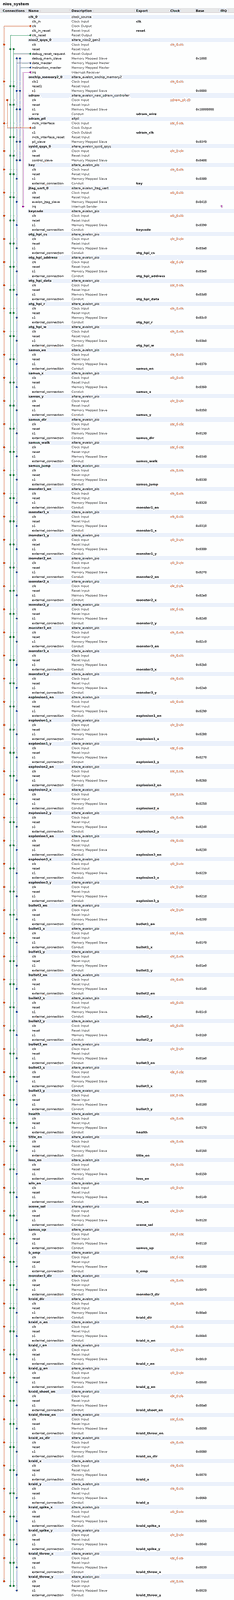
[diagram p0: system contents, whole]
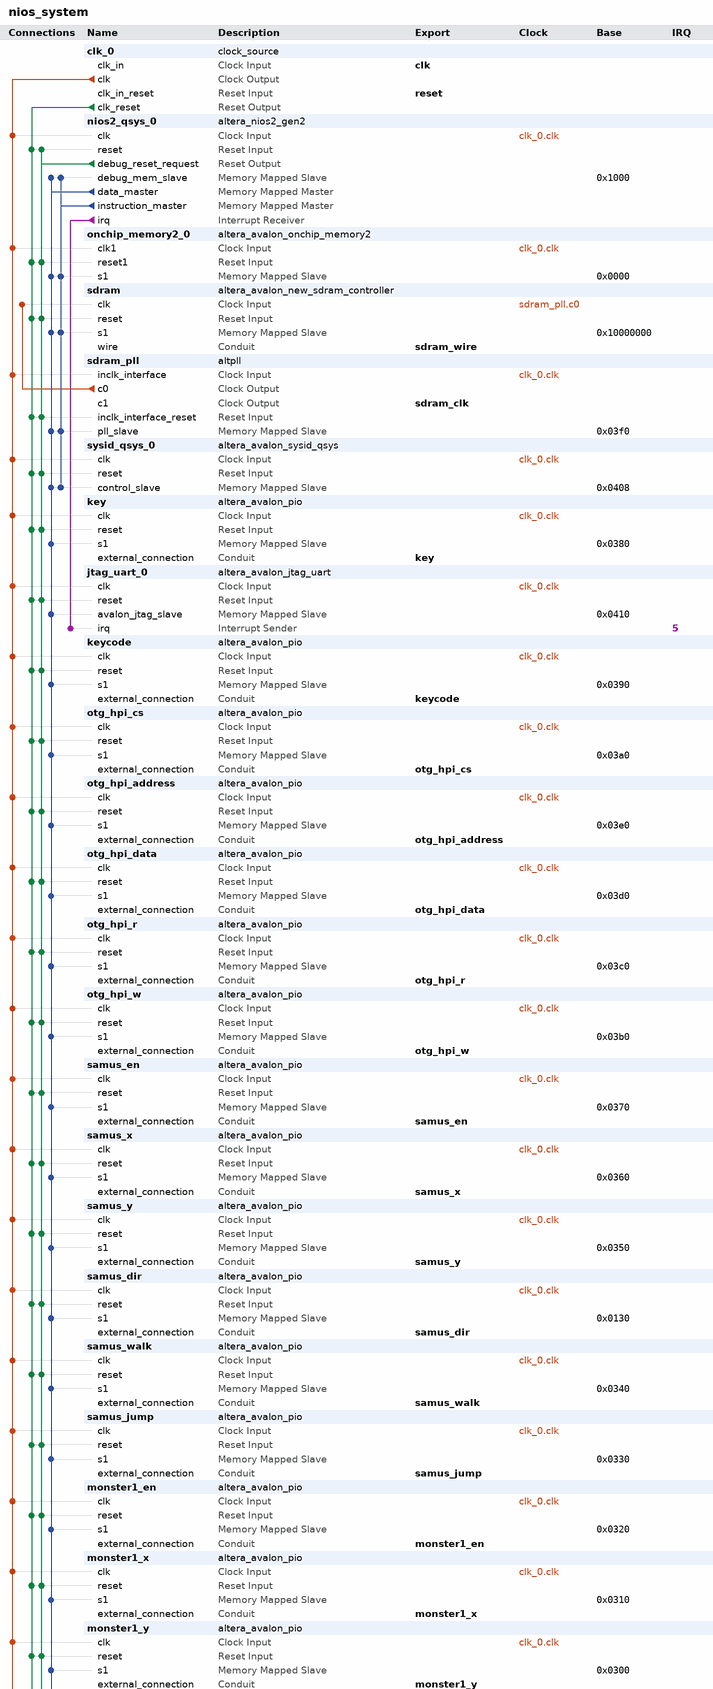
[diagram p1: system contents, upper part]
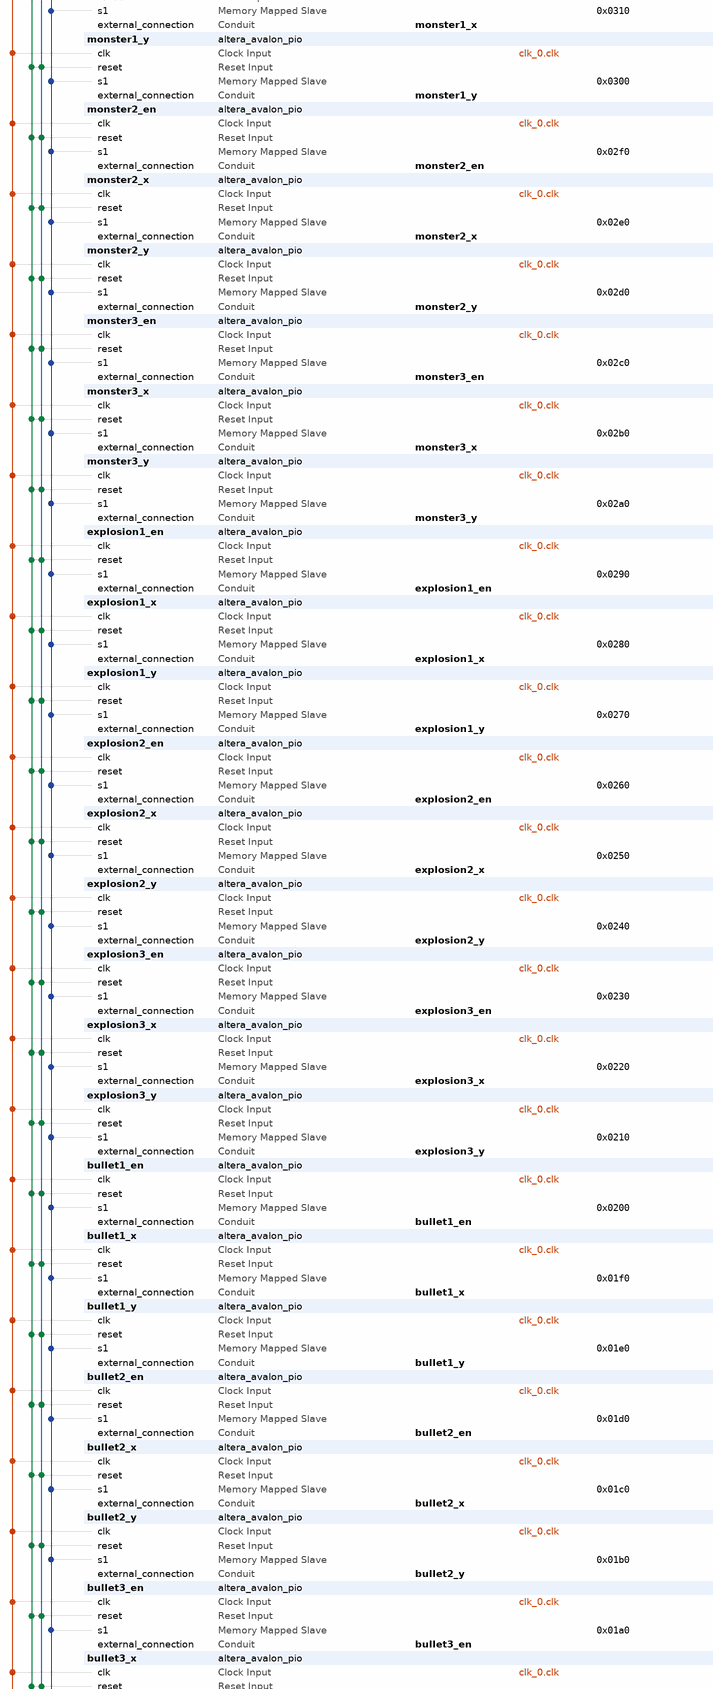
[diagram p2: system contents, middle part]
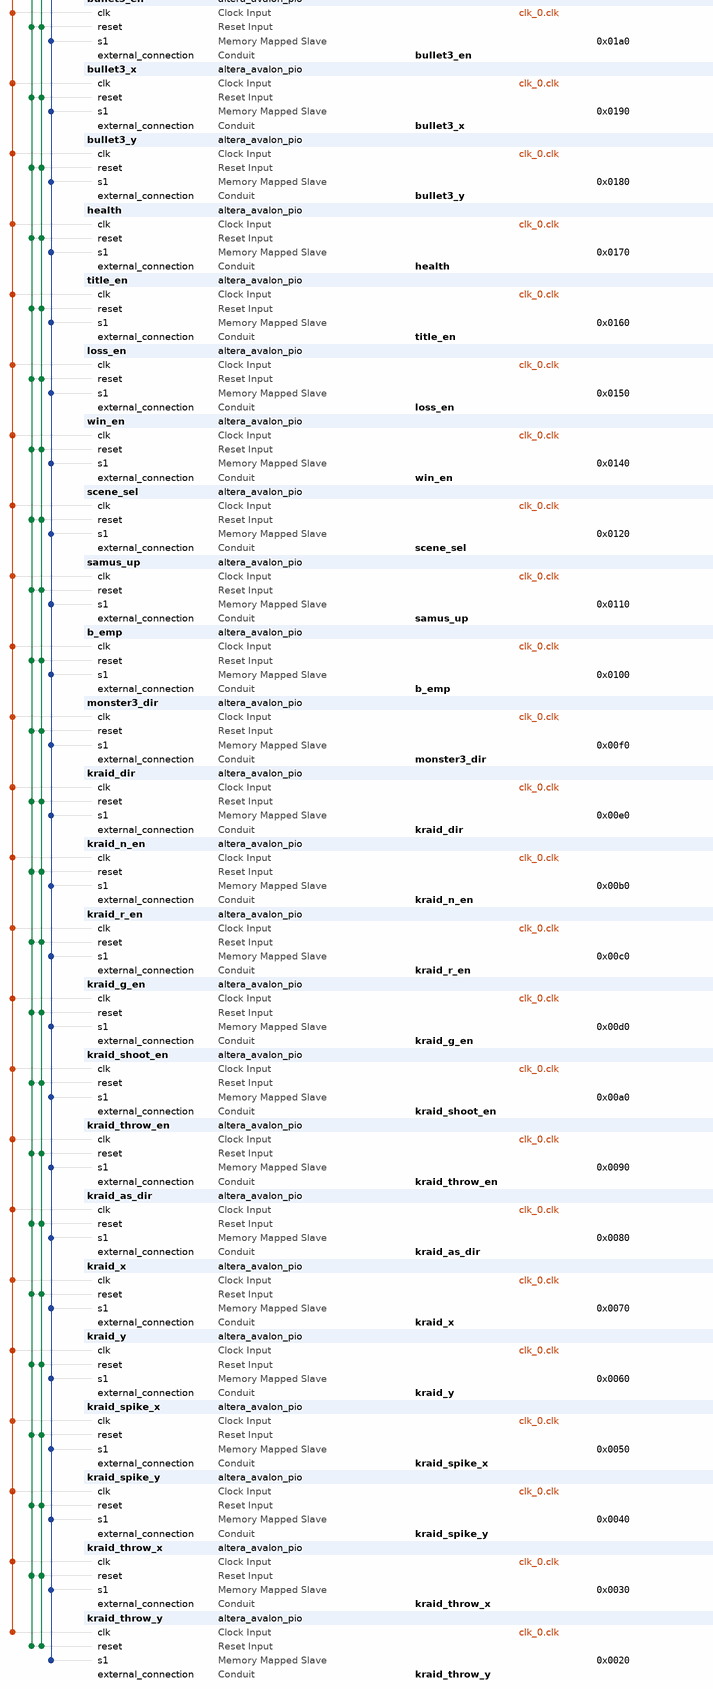
[diagram p3: system contents, lower part]
# Platform Designer (Qsys) system nios_system, Cyclone IV E EP4CE115F29C7
# Parameters at their usual value, and those the tool derives, are not listed.
package require -exact qsys 15.0
create_system nios_system
set_project_property DEVICE_FAMILY {Cyclone IV E}
set_project_property DEVICE EP4CE115F29C7

add_instance clk_0 clock_source 15.0
set_instance_parameter_value clk_0 clockFrequency 50000000

add_instance nios2_qsys_0 altera_nios2_gen2 15.0
set_instance_parameter_value nios2_qsys_0 dcache_size 2048
set_instance_parameter_value nios2_qsys_0 exceptionSlave sdram.s1
set_instance_parameter_value nios2_qsys_0 icache_size 4096
set_instance_parameter_value nios2_qsys_0 impl Tiny
set_instance_parameter_value nios2_qsys_0 resetSlave sdram.s1

add_instance onchip_memory2_0 altera_avalon_onchip_memory2 15.0
set_instance_parameter_value onchip_memory2_0 dataWidth 32
set_instance_parameter_value onchip_memory2_0 dualPort false
set_instance_parameter_value onchip_memory2_0 initMemContent true
set_instance_parameter_value onchip_memory2_0 initializationFileName onchip_mem.hex
set_instance_parameter_value onchip_memory2_0 memorySize 16

add_instance sdram altera_avalon_new_sdram_controller 15.0
set_instance_parameter_value sdram TAC 5.5
set_instance_parameter_value sdram TRCD 20.0
set_instance_parameter_value sdram TRP 20.0
set_instance_parameter_value sdram casLatency 3
set_instance_parameter_value sdram columnWidth 10
set_instance_parameter_value sdram dataWidth 32
set_instance_parameter_value sdram generateSimulationModel false
set_instance_parameter_value sdram model single_Micron_MT48LC4M32B2_7_chip
set_instance_parameter_value sdram numberOfBanks 4
set_instance_parameter_value sdram numberOfChipSelects 1
set_instance_parameter_value sdram powerUpDelay 200.0
set_instance_parameter_value sdram refreshPeriod 7.8125
set_instance_parameter_value sdram rowWidth 13

add_instance sdram_pll altpll 15.0
set_instance_parameter_value sdram_pll CLK0_DIVIDE_BY 1
set_instance_parameter_value sdram_pll CLK0_MULTIPLY_BY 1
set_instance_parameter_value sdram_pll CLK1_DIVIDE_BY 1
set_instance_parameter_value sdram_pll CLK1_DUTY_CYCLE 50
set_instance_parameter_value sdram_pll CLK1_MULTIPLY_BY 1
set_instance_parameter_value sdram_pll CLK1_PHASE_SHIFT -3000
set_instance_parameter_value sdram_pll INCLK0_INPUT_FREQUENCY 20000
set_instance_parameter_value sdram_pll PORT_ARESET PORT_UNUSED
set_instance_parameter_value sdram_pll PORT_LOCKED PORT_UNUSED
set_instance_parameter_value sdram_pll PORT_clk1 PORT_USED
set_instance_parameter_value sdram_pll PORT_clk2 PORT_UNUSED
set_instance_parameter_value sdram_pll PORT_clk3 PORT_UNUSED

add_instance sysid_qsys_0 altera_avalon_sysid_qsys 15.0
set_instance_parameter_value sysid_qsys_0 id 0

add_instance key altera_avalon_pio 15.0
set_instance_parameter_value key captureEdge true
set_instance_parameter_value key direction Input
set_instance_parameter_value key width 2

add_instance jtag_uart_0 altera_avalon_jtag_uart 15.0
set_instance_parameter_value jtag_uart_0 simInteractiveOptions NO_INTERACTIVE_WINDOWS

add_instance keycode altera_avalon_pio 15.0
set_instance_parameter_value keycode direction Output
set_instance_parameter_value keycode width 16

add_instance otg_hpi_cs altera_avalon_pio 15.0
set_instance_parameter_value otg_hpi_cs direction Output
set_instance_parameter_value otg_hpi_cs width 1

add_instance otg_hpi_address altera_avalon_pio 15.0
set_instance_parameter_value otg_hpi_address direction Output
set_instance_parameter_value otg_hpi_address width 2

add_instance otg_hpi_data altera_avalon_pio 15.0
set_instance_parameter_value otg_hpi_data direction InOut
set_instance_parameter_value otg_hpi_data width 16

add_instance otg_hpi_r altera_avalon_pio 15.0
set_instance_parameter_value otg_hpi_r direction Output
set_instance_parameter_value otg_hpi_r width 1

add_instance otg_hpi_w altera_avalon_pio 15.0
set_instance_parameter_value otg_hpi_w direction Output
set_instance_parameter_value otg_hpi_w width 1

add_instance samus_en altera_avalon_pio 15.0
set_instance_parameter_value samus_en direction Output
set_instance_parameter_value samus_en width 1

add_instance samus_x altera_avalon_pio 15.0
set_instance_parameter_value samus_x direction Output
set_instance_parameter_value samus_x width 10

add_instance samus_y altera_avalon_pio 15.0
set_instance_parameter_value samus_y direction Output
set_instance_parameter_value samus_y width 10

add_instance samus_dir altera_avalon_pio 15.0
set_instance_parameter_value samus_dir direction Output
set_instance_parameter_value samus_dir width 1

add_instance samus_walk altera_avalon_pio 15.0
set_instance_parameter_value samus_walk direction Output
set_instance_parameter_value samus_walk width 1

add_instance samus_jump altera_avalon_pio 15.0
set_instance_parameter_value samus_jump direction Output
set_instance_parameter_value samus_jump width 1

add_instance monster1_en altera_avalon_pio 15.0
set_instance_parameter_value monster1_en direction Output
set_instance_parameter_value monster1_en width 1

add_instance monster1_x altera_avalon_pio 15.0
set_instance_parameter_value monster1_x direction Output
set_instance_parameter_value monster1_x width 10

add_instance monster1_y altera_avalon_pio 15.0
set_instance_parameter_value monster1_y direction Output
set_instance_parameter_value monster1_y width 10

add_instance monster2_en altera_avalon_pio 15.0
set_instance_parameter_value monster2_en direction Output
set_instance_parameter_value monster2_en width 1

add_instance monster2_x altera_avalon_pio 15.0
set_instance_parameter_value monster2_x direction Output
set_instance_parameter_value monster2_x width 10

add_instance monster2_y altera_avalon_pio 15.0
set_instance_parameter_value monster2_y direction Output
set_instance_parameter_value monster2_y width 10

add_instance monster3_en altera_avalon_pio 15.0
set_instance_parameter_value monster3_en direction Output
set_instance_parameter_value monster3_en width 1

add_instance monster3_x altera_avalon_pio 15.0
set_instance_parameter_value monster3_x direction Output
set_instance_parameter_value monster3_x width 10

add_instance monster3_y altera_avalon_pio 15.0
set_instance_parameter_value monster3_y direction Output
set_instance_parameter_value monster3_y width 10

add_instance explosion1_en altera_avalon_pio 15.0
set_instance_parameter_value explosion1_en direction Output
set_instance_parameter_value explosion1_en width 1

add_instance explosion1_x altera_avalon_pio 15.0
set_instance_parameter_value explosion1_x direction Output
set_instance_parameter_value explosion1_x width 10

add_instance explosion1_y altera_avalon_pio 15.0
set_instance_parameter_value explosion1_y direction Output
set_instance_parameter_value explosion1_y width 10

add_instance explosion2_en altera_avalon_pio 15.0
set_instance_parameter_value explosion2_en direction Output
set_instance_parameter_value explosion2_en width 1

add_instance explosion2_x altera_avalon_pio 15.0
set_instance_parameter_value explosion2_x direction Output
set_instance_parameter_value explosion2_x width 10

add_instance explosion2_y altera_avalon_pio 15.0
set_instance_parameter_value explosion2_y direction Output
set_instance_parameter_value explosion2_y width 10

add_instance explosion3_en altera_avalon_pio 15.0
set_instance_parameter_value explosion3_en direction Output
set_instance_parameter_value explosion3_en width 1

add_instance explosion3_x altera_avalon_pio 15.0
set_instance_parameter_value explosion3_x direction Output
set_instance_parameter_value explosion3_x width 10

add_instance explosion3_y altera_avalon_pio 15.0
set_instance_parameter_value explosion3_y direction Output
set_instance_parameter_value explosion3_y width 10

add_instance bullet1_en altera_avalon_pio 15.0
set_instance_parameter_value bullet1_en direction Output
set_instance_parameter_value bullet1_en width 1

add_instance bullet1_x altera_avalon_pio 15.0
set_instance_parameter_value bullet1_x direction Output
set_instance_parameter_value bullet1_x width 10

add_instance bullet1_y altera_avalon_pio 15.0
set_instance_parameter_value bullet1_y direction Output
set_instance_parameter_value bullet1_y width 10

add_instance bullet2_en altera_avalon_pio 15.0
set_instance_parameter_value bullet2_en direction Output
set_instance_parameter_value bullet2_en width 1

add_instance bullet2_x altera_avalon_pio 15.0
set_instance_parameter_value bullet2_x direction Output
set_instance_parameter_value bullet2_x width 10

add_instance bullet2_y altera_avalon_pio 15.0
set_instance_parameter_value bullet2_y direction Output
set_instance_parameter_value bullet2_y width 10

add_instance bullet3_en altera_avalon_pio 15.0
set_instance_parameter_value bullet3_en direction Output
set_instance_parameter_value bullet3_en width 1

add_instance bullet3_x altera_avalon_pio 15.0
set_instance_parameter_value bullet3_x direction Output
set_instance_parameter_value bullet3_x width 10

add_instance bullet3_y altera_avalon_pio 15.0
set_instance_parameter_value bullet3_y direction Output
set_instance_parameter_value bullet3_y width 10

add_instance health altera_avalon_pio 15.0
set_instance_parameter_value health direction Output
set_instance_parameter_value health width 2

add_instance title_en altera_avalon_pio 15.0
set_instance_parameter_value title_en direction Output
set_instance_parameter_value title_en width 1

add_instance loss_en altera_avalon_pio 15.0
set_instance_parameter_value loss_en direction Output
set_instance_parameter_value loss_en width 1

add_instance win_en altera_avalon_pio 15.0
set_instance_parameter_value win_en direction Output
set_instance_parameter_value win_en width 1

add_instance scene_sel altera_avalon_pio 15.0
set_instance_parameter_value scene_sel direction Output
set_instance_parameter_value scene_sel width 3

add_instance samus_up altera_avalon_pio 15.0
set_instance_parameter_value samus_up direction Output
set_instance_parameter_value samus_up width 1

add_instance b_emp altera_avalon_pio 15.0
set_instance_parameter_value b_emp direction Output
set_instance_parameter_value b_emp width 1

add_instance monster3_dir altera_avalon_pio 15.0
set_instance_parameter_value monster3_dir direction Output
set_instance_parameter_value monster3_dir width 1

add_instance kraid_dir altera_avalon_pio 15.0
set_instance_parameter_value kraid_dir direction Output
set_instance_parameter_value kraid_dir width 1

add_instance kraid_n_en altera_avalon_pio 15.0
set_instance_parameter_value kraid_n_en direction Output
set_instance_parameter_value kraid_n_en width 1

add_instance kraid_r_en altera_avalon_pio 15.0
set_instance_parameter_value kraid_r_en direction Output
set_instance_parameter_value kraid_r_en width 1

add_instance kraid_g_en altera_avalon_pio 15.0
set_instance_parameter_value kraid_g_en direction Output
set_instance_parameter_value kraid_g_en width 1

add_instance kraid_shoot_en altera_avalon_pio 15.0
set_instance_parameter_value kraid_shoot_en direction Output
set_instance_parameter_value kraid_shoot_en width 1

add_instance kraid_throw_en altera_avalon_pio 15.0
set_instance_parameter_value kraid_throw_en direction Output
set_instance_parameter_value kraid_throw_en width 1

add_instance kraid_as_dir altera_avalon_pio 15.0
set_instance_parameter_value kraid_as_dir direction Output
set_instance_parameter_value kraid_as_dir width 1

add_instance kraid_x altera_avalon_pio 15.0
set_instance_parameter_value kraid_x direction Output
set_instance_parameter_value kraid_x width 10

add_instance kraid_y altera_avalon_pio 15.0
set_instance_parameter_value kraid_y direction Output
set_instance_parameter_value kraid_y width 10

add_instance kraid_spike_x altera_avalon_pio 15.0
set_instance_parameter_value kraid_spike_x direction Output
set_instance_parameter_value kraid_spike_x width 10

add_instance kraid_spike_y altera_avalon_pio 15.0
set_instance_parameter_value kraid_spike_y direction Output
set_instance_parameter_value kraid_spike_y width 10

add_instance kraid_throw_x altera_avalon_pio 15.0
set_instance_parameter_value kraid_throw_x direction Output
set_instance_parameter_value kraid_throw_x width 10

add_instance kraid_throw_y altera_avalon_pio 15.0
set_instance_parameter_value kraid_throw_y direction Output
set_instance_parameter_value kraid_throw_y width 10

# connections
add_connection clk_0.clk b_emp.clk clock
add_connection clk_0.clk bullet1_en.clk clock
add_connection clk_0.clk bullet1_x.clk clock
add_connection clk_0.clk bullet1_y.clk clock
add_connection clk_0.clk bullet2_en.clk clock
add_connection clk_0.clk bullet2_x.clk clock
add_connection clk_0.clk bullet2_y.clk clock
add_connection clk_0.clk bullet3_en.clk clock
add_connection clk_0.clk bullet3_x.clk clock
add_connection clk_0.clk bullet3_y.clk clock
add_connection clk_0.clk explosion1_en.clk clock
add_connection clk_0.clk explosion1_x.clk clock
add_connection clk_0.clk explosion1_y.clk clock
add_connection clk_0.clk explosion2_en.clk clock
add_connection clk_0.clk explosion2_x.clk clock
add_connection clk_0.clk explosion2_y.clk clock
add_connection clk_0.clk explosion3_en.clk clock
add_connection clk_0.clk explosion3_x.clk clock
add_connection clk_0.clk explosion3_y.clk clock
add_connection clk_0.clk health.clk clock
add_connection clk_0.clk jtag_uart_0.clk clock
add_connection clk_0.clk key.clk clock
add_connection clk_0.clk keycode.clk clock
add_connection clk_0.clk kraid_as_dir.clk clock
add_connection clk_0.clk kraid_dir.clk clock
add_connection clk_0.clk kraid_g_en.clk clock
add_connection clk_0.clk kraid_n_en.clk clock
add_connection clk_0.clk kraid_r_en.clk clock
add_connection clk_0.clk kraid_shoot_en.clk clock
add_connection clk_0.clk kraid_spike_x.clk clock
add_connection clk_0.clk kraid_spike_y.clk clock
add_connection clk_0.clk kraid_throw_en.clk clock
add_connection clk_0.clk kraid_throw_x.clk clock
add_connection clk_0.clk kraid_throw_y.clk clock
add_connection clk_0.clk kraid_x.clk clock
add_connection clk_0.clk kraid_y.clk clock
add_connection clk_0.clk loss_en.clk clock
add_connection clk_0.clk monster1_en.clk clock
add_connection clk_0.clk monster1_x.clk clock
add_connection clk_0.clk monster1_y.clk clock
add_connection clk_0.clk monster2_en.clk clock
add_connection clk_0.clk monster2_x.clk clock
add_connection clk_0.clk monster2_y.clk clock
add_connection clk_0.clk monster3_dir.clk clock
add_connection clk_0.clk monster3_en.clk clock
add_connection clk_0.clk monster3_x.clk clock
add_connection clk_0.clk monster3_y.clk clock
add_connection clk_0.clk nios2_qsys_0.clk clock
add_connection clk_0.clk onchip_memory2_0.clk1 clock
add_connection clk_0.clk otg_hpi_address.clk clock
add_connection clk_0.clk otg_hpi_cs.clk clock
add_connection clk_0.clk otg_hpi_data.clk clock
add_connection clk_0.clk otg_hpi_r.clk clock
add_connection clk_0.clk otg_hpi_w.clk clock
add_connection clk_0.clk samus_dir.clk clock
add_connection clk_0.clk samus_en.clk clock
add_connection clk_0.clk samus_jump.clk clock
add_connection clk_0.clk samus_up.clk clock
add_connection clk_0.clk samus_walk.clk clock
add_connection clk_0.clk samus_x.clk clock
add_connection clk_0.clk samus_y.clk clock
add_connection clk_0.clk scene_sel.clk clock
add_connection clk_0.clk sdram_pll.inclk_interface clock
add_connection clk_0.clk sysid_qsys_0.clk clock
add_connection clk_0.clk title_en.clk clock
add_connection clk_0.clk win_en.clk clock
add_connection sdram_pll.c0 sdram.clk clock
add_connection clk_0.clk_reset b_emp.reset reset
add_connection clk_0.clk_reset bullet1_en.reset reset
add_connection clk_0.clk_reset bullet1_x.reset reset
add_connection clk_0.clk_reset bullet1_y.reset reset
add_connection clk_0.clk_reset bullet2_en.reset reset
add_connection clk_0.clk_reset bullet2_x.reset reset
add_connection clk_0.clk_reset bullet2_y.reset reset
add_connection clk_0.clk_reset bullet3_en.reset reset
add_connection clk_0.clk_reset bullet3_x.reset reset
add_connection clk_0.clk_reset bullet3_y.reset reset
add_connection clk_0.clk_reset explosion1_en.reset reset
add_connection clk_0.clk_reset explosion1_x.reset reset
add_connection clk_0.clk_reset explosion1_y.reset reset
add_connection clk_0.clk_reset explosion2_en.reset reset
add_connection clk_0.clk_reset explosion2_x.reset reset
add_connection clk_0.clk_reset explosion2_y.reset reset
add_connection clk_0.clk_reset explosion3_en.reset reset
add_connection clk_0.clk_reset explosion3_x.reset reset
add_connection clk_0.clk_reset explosion3_y.reset reset
add_connection clk_0.clk_reset health.reset reset
add_connection clk_0.clk_reset jtag_uart_0.reset reset
add_connection clk_0.clk_reset key.reset reset
add_connection clk_0.clk_reset keycode.reset reset
add_connection clk_0.clk_reset kraid_as_dir.reset reset
add_connection clk_0.clk_reset kraid_dir.reset reset
add_connection clk_0.clk_reset kraid_g_en.reset reset
add_connection clk_0.clk_reset kraid_n_en.reset reset
add_connection clk_0.clk_reset kraid_r_en.reset reset
add_connection clk_0.clk_reset kraid_shoot_en.reset reset
add_connection clk_0.clk_reset kraid_spike_x.reset reset
add_connection clk_0.clk_reset kraid_spike_y.reset reset
add_connection clk_0.clk_reset kraid_throw_en.reset reset
add_connection clk_0.clk_reset kraid_throw_x.reset reset
add_connection clk_0.clk_reset kraid_throw_y.reset reset
add_connection clk_0.clk_reset kraid_x.reset reset
add_connection clk_0.clk_reset kraid_y.reset reset
add_connection clk_0.clk_reset loss_en.reset reset
add_connection clk_0.clk_reset monster1_en.reset reset
add_connection clk_0.clk_reset monster1_x.reset reset
add_connection clk_0.clk_reset monster1_y.reset reset
add_connection clk_0.clk_reset monster2_en.reset reset
add_connection clk_0.clk_reset monster2_x.reset reset
add_connection clk_0.clk_reset monster2_y.reset reset
add_connection clk_0.clk_reset monster3_dir.reset reset
add_connection clk_0.clk_reset monster3_en.reset reset
add_connection clk_0.clk_reset monster3_x.reset reset
add_connection clk_0.clk_reset monster3_y.reset reset
add_connection clk_0.clk_reset nios2_qsys_0.reset reset
add_connection clk_0.clk_reset onchip_memory2_0.reset1 reset
add_connection clk_0.clk_reset otg_hpi_address.reset reset
add_connection clk_0.clk_reset otg_hpi_cs.reset reset
add_connection clk_0.clk_reset otg_hpi_data.reset reset
add_connection clk_0.clk_reset otg_hpi_r.reset reset
add_connection clk_0.clk_reset otg_hpi_w.reset reset
add_connection clk_0.clk_reset samus_dir.reset reset
add_connection clk_0.clk_reset samus_en.reset reset
add_connection clk_0.clk_reset samus_jump.reset reset
add_connection clk_0.clk_reset samus_up.reset reset
add_connection clk_0.clk_reset samus_walk.reset reset
add_connection clk_0.clk_reset samus_x.reset reset
add_connection clk_0.clk_reset samus_y.reset reset
add_connection clk_0.clk_reset scene_sel.reset reset
add_connection clk_0.clk_reset sdram.reset reset
add_connection clk_0.clk_reset sdram_pll.inclk_interface_reset reset
add_connection clk_0.clk_reset sysid_qsys_0.reset reset
add_connection clk_0.clk_reset title_en.reset reset
add_connection clk_0.clk_reset win_en.reset reset
add_connection nios2_qsys_0.debug_reset_request b_emp.reset reset
add_connection nios2_qsys_0.debug_reset_request bullet1_en.reset reset
add_connection nios2_qsys_0.debug_reset_request bullet1_x.reset reset
add_connection nios2_qsys_0.debug_reset_request bullet1_y.reset reset
add_connection nios2_qsys_0.debug_reset_request bullet2_en.reset reset
add_connection nios2_qsys_0.debug_reset_request bullet2_x.reset reset
add_connection nios2_qsys_0.debug_reset_request bullet2_y.reset reset
add_connection nios2_qsys_0.debug_reset_request bullet3_en.reset reset
add_connection nios2_qsys_0.debug_reset_request bullet3_x.reset reset
add_connection nios2_qsys_0.debug_reset_request bullet3_y.reset reset
add_connection nios2_qsys_0.debug_reset_request explosion1_en.reset reset
add_connection nios2_qsys_0.debug_reset_request explosion1_x.reset reset
add_connection nios2_qsys_0.debug_reset_request explosion1_y.reset reset
add_connection nios2_qsys_0.debug_reset_request explosion2_en.reset reset
add_connection nios2_qsys_0.debug_reset_request explosion2_x.reset reset
add_connection nios2_qsys_0.debug_reset_request explosion2_y.reset reset
add_connection nios2_qsys_0.debug_reset_request explosion3_en.reset reset
add_connection nios2_qsys_0.debug_reset_request explosion3_x.reset reset
add_connection nios2_qsys_0.debug_reset_request explosion3_y.reset reset
add_connection nios2_qsys_0.debug_reset_request health.reset reset
add_connection nios2_qsys_0.debug_reset_request jtag_uart_0.reset reset
add_connection nios2_qsys_0.debug_reset_request key.reset reset
add_connection nios2_qsys_0.debug_reset_request keycode.reset reset
add_connection nios2_qsys_0.debug_reset_request kraid_as_dir.reset reset
add_connection nios2_qsys_0.debug_reset_request kraid_dir.reset reset
add_connection nios2_qsys_0.debug_reset_request kraid_g_en.reset reset
add_connection nios2_qsys_0.debug_reset_request kraid_n_en.reset reset
add_connection nios2_qsys_0.debug_reset_request kraid_r_en.reset reset
add_connection nios2_qsys_0.debug_reset_request kraid_shoot_en.reset reset
add_connection nios2_qsys_0.debug_reset_request kraid_spike_x.reset reset
add_connection nios2_qsys_0.debug_reset_request kraid_spike_y.reset reset
add_connection nios2_qsys_0.debug_reset_request kraid_throw_en.reset reset
add_connection nios2_qsys_0.debug_reset_request kraid_throw_x.reset reset
add_connection nios2_qsys_0.debug_reset_request kraid_throw_y.reset reset
add_connection nios2_qsys_0.debug_reset_request kraid_x.reset reset
add_connection nios2_qsys_0.debug_reset_request kraid_y.reset reset
add_connection nios2_qsys_0.debug_reset_request loss_en.reset reset
add_connection nios2_qsys_0.debug_reset_request monster1_en.reset reset
add_connection nios2_qsys_0.debug_reset_request monster1_x.reset reset
add_connection nios2_qsys_0.debug_reset_request monster1_y.reset reset
add_connection nios2_qsys_0.debug_reset_request monster2_en.reset reset
add_connection nios2_qsys_0.debug_reset_request monster2_x.reset reset
add_connection nios2_qsys_0.debug_reset_request monster2_y.reset reset
add_connection nios2_qsys_0.debug_reset_request monster3_dir.reset reset
add_connection nios2_qsys_0.debug_reset_request monster3_en.reset reset
add_connection nios2_qsys_0.debug_reset_request monster3_x.reset reset
add_connection nios2_qsys_0.debug_reset_request monster3_y.reset reset
add_connection nios2_qsys_0.debug_reset_request nios2_qsys_0.reset reset
add_connection nios2_qsys_0.debug_reset_request onchip_memory2_0.reset1 reset
add_connection nios2_qsys_0.debug_reset_request otg_hpi_address.reset reset
add_connection nios2_qsys_0.debug_reset_request otg_hpi_cs.reset reset
add_connection nios2_qsys_0.debug_reset_request otg_hpi_data.reset reset
add_connection nios2_qsys_0.debug_reset_request otg_hpi_r.reset reset
add_connection nios2_qsys_0.debug_reset_request otg_hpi_w.reset reset
add_connection nios2_qsys_0.debug_reset_request samus_dir.reset reset
add_connection nios2_qsys_0.debug_reset_request samus_en.reset reset
add_connection nios2_qsys_0.debug_reset_request samus_jump.reset reset
add_connection nios2_qsys_0.debug_reset_request samus_up.reset reset
add_connection nios2_qsys_0.debug_reset_request samus_walk.reset reset
add_connection nios2_qsys_0.debug_reset_request samus_x.reset reset
add_connection nios2_qsys_0.debug_reset_request samus_y.reset reset
add_connection nios2_qsys_0.debug_reset_request scene_sel.reset reset
add_connection nios2_qsys_0.debug_reset_request sdram.reset reset
add_connection nios2_qsys_0.debug_reset_request sdram_pll.inclk_interface_reset reset
add_connection nios2_qsys_0.debug_reset_request sysid_qsys_0.reset reset
add_connection nios2_qsys_0.debug_reset_request title_en.reset reset
add_connection nios2_qsys_0.debug_reset_request win_en.reset reset
add_connection nios2_qsys_0.data_master b_emp.s1 avalon
set_connection_parameter_value nios2_qsys_0.data_master/b_emp.s1 baseAddress 0x0100
add_connection nios2_qsys_0.data_master bullet1_en.s1 avalon
set_connection_parameter_value nios2_qsys_0.data_master/bullet1_en.s1 baseAddress 0x0200
add_connection nios2_qsys_0.data_master bullet1_x.s1 avalon
set_connection_parameter_value nios2_qsys_0.data_master/bullet1_x.s1 baseAddress 0x01f0
add_connection nios2_qsys_0.data_master bullet1_y.s1 avalon
set_connection_parameter_value nios2_qsys_0.data_master/bullet1_y.s1 baseAddress 0x01e0
add_connection nios2_qsys_0.data_master bullet2_en.s1 avalon
set_connection_parameter_value nios2_qsys_0.data_master/bullet2_en.s1 baseAddress 0x01d0
add_connection nios2_qsys_0.data_master bullet2_x.s1 avalon
set_connection_parameter_value nios2_qsys_0.data_master/bullet2_x.s1 baseAddress 0x01c0
add_connection nios2_qsys_0.data_master bullet2_y.s1 avalon
set_connection_parameter_value nios2_qsys_0.data_master/bullet2_y.s1 baseAddress 0x01b0
add_connection nios2_qsys_0.data_master bullet3_en.s1 avalon
set_connection_parameter_value nios2_qsys_0.data_master/bullet3_en.s1 baseAddress 0x01a0
add_connection nios2_qsys_0.data_master bullet3_x.s1 avalon
set_connection_parameter_value nios2_qsys_0.data_master/bullet3_x.s1 baseAddress 0x0190
add_connection nios2_qsys_0.data_master bullet3_y.s1 avalon
set_connection_parameter_value nios2_qsys_0.data_master/bullet3_y.s1 baseAddress 0x0180
add_connection nios2_qsys_0.data_master explosion1_en.s1 avalon
set_connection_parameter_value nios2_qsys_0.data_master/explosion1_en.s1 baseAddress 0x0290
add_connection nios2_qsys_0.data_master explosion1_x.s1 avalon
set_connection_parameter_value nios2_qsys_0.data_master/explosion1_x.s1 baseAddress 0x0280
add_connection nios2_qsys_0.data_master explosion1_y.s1 avalon
set_connection_parameter_value nios2_qsys_0.data_master/explosion1_y.s1 baseAddress 0x0270
add_connection nios2_qsys_0.data_master explosion2_en.s1 avalon
set_connection_parameter_value nios2_qsys_0.data_master/explosion2_en.s1 baseAddress 0x0260
add_connection nios2_qsys_0.data_master explosion2_x.s1 avalon
set_connection_parameter_value nios2_qsys_0.data_master/explosion2_x.s1 baseAddress 0x0250
add_connection nios2_qsys_0.data_master explosion2_y.s1 avalon
set_connection_parameter_value nios2_qsys_0.data_master/explosion2_y.s1 baseAddress 0x0240
add_connection nios2_qsys_0.data_master explosion3_en.s1 avalon
set_connection_parameter_value nios2_qsys_0.data_master/explosion3_en.s1 baseAddress 0x0230
add_connection nios2_qsys_0.data_master explosion3_x.s1 avalon
set_connection_parameter_value nios2_qsys_0.data_master/explosion3_x.s1 baseAddress 0x0220
add_connection nios2_qsys_0.data_master explosion3_y.s1 avalon
set_connection_parameter_value nios2_qsys_0.data_master/explosion3_y.s1 baseAddress 0x0210
add_connection nios2_qsys_0.data_master health.s1 avalon
set_connection_parameter_value nios2_qsys_0.data_master/health.s1 baseAddress 0x0170
add_connection nios2_qsys_0.data_master jtag_uart_0.avalon_jtag_slave avalon
set_connection_parameter_value nios2_qsys_0.data_master/jtag_uart_0.avalon_jtag_slave baseAddress 0x0410
add_connection nios2_qsys_0.data_master key.s1 avalon
set_connection_parameter_value nios2_qsys_0.data_master/key.s1 baseAddress 0x0380
add_connection nios2_qsys_0.data_master keycode.s1 avalon
set_connection_parameter_value nios2_qsys_0.data_master/keycode.s1 baseAddress 0x0390
add_connection nios2_qsys_0.data_master kraid_as_dir.s1 avalon
set_connection_parameter_value nios2_qsys_0.data_master/kraid_as_dir.s1 baseAddress 0x0080
add_connection nios2_qsys_0.data_master kraid_dir.s1 avalon
set_connection_parameter_value nios2_qsys_0.data_master/kraid_dir.s1 baseAddress 0x00e0
add_connection nios2_qsys_0.data_master kraid_g_en.s1 avalon
set_connection_parameter_value nios2_qsys_0.data_master/kraid_g_en.s1 baseAddress 0x00d0
add_connection nios2_qsys_0.data_master kraid_n_en.s1 avalon
set_connection_parameter_value nios2_qsys_0.data_master/kraid_n_en.s1 baseAddress 0x00b0
add_connection nios2_qsys_0.data_master kraid_r_en.s1 avalon
set_connection_parameter_value nios2_qsys_0.data_master/kraid_r_en.s1 baseAddress 0x00c0
add_connection nios2_qsys_0.data_master kraid_shoot_en.s1 avalon
set_connection_parameter_value nios2_qsys_0.data_master/kraid_shoot_en.s1 baseAddress 0x00a0
add_connection nios2_qsys_0.data_master kraid_spike_x.s1 avalon
set_connection_parameter_value nios2_qsys_0.data_master/kraid_spike_x.s1 baseAddress 0x0050
add_connection nios2_qsys_0.data_master kraid_spike_y.s1 avalon
set_connection_parameter_value nios2_qsys_0.data_master/kraid_spike_y.s1 baseAddress 0x0040
add_connection nios2_qsys_0.data_master kraid_throw_en.s1 avalon
set_connection_parameter_value nios2_qsys_0.data_master/kraid_throw_en.s1 baseAddress 0x0090
add_connection nios2_qsys_0.data_master kraid_throw_x.s1 avalon
set_connection_parameter_value nios2_qsys_0.data_master/kraid_throw_x.s1 baseAddress 0x0030
add_connection nios2_qsys_0.data_master kraid_throw_y.s1 avalon
set_connection_parameter_value nios2_qsys_0.data_master/kraid_throw_y.s1 baseAddress 0x0020
add_connection nios2_qsys_0.data_master kraid_x.s1 avalon
set_connection_parameter_value nios2_qsys_0.data_master/kraid_x.s1 baseAddress 0x0070
add_connection nios2_qsys_0.data_master kraid_y.s1 avalon
set_connection_parameter_value nios2_qsys_0.data_master/kraid_y.s1 baseAddress 0x0060
add_connection nios2_qsys_0.data_master loss_en.s1 avalon
set_connection_parameter_value nios2_qsys_0.data_master/loss_en.s1 baseAddress 0x0150
add_connection nios2_qsys_0.data_master monster1_en.s1 avalon
set_connection_parameter_value nios2_qsys_0.data_master/monster1_en.s1 baseAddress 0x0320
add_connection nios2_qsys_0.data_master monster1_x.s1 avalon
set_connection_parameter_value nios2_qsys_0.data_master/monster1_x.s1 baseAddress 0x0310
add_connection nios2_qsys_0.data_master monster1_y.s1 avalon
set_connection_parameter_value nios2_qsys_0.data_master/monster1_y.s1 baseAddress 0x0300
add_connection nios2_qsys_0.data_master monster2_en.s1 avalon
set_connection_parameter_value nios2_qsys_0.data_master/monster2_en.s1 baseAddress 0x02f0
add_connection nios2_qsys_0.data_master monster2_x.s1 avalon
set_connection_parameter_value nios2_qsys_0.data_master/monster2_x.s1 baseAddress 0x02e0
add_connection nios2_qsys_0.data_master monster2_y.s1 avalon
set_connection_parameter_value nios2_qsys_0.data_master/monster2_y.s1 baseAddress 0x02d0
add_connection nios2_qsys_0.data_master monster3_dir.s1 avalon
set_connection_parameter_value nios2_qsys_0.data_master/monster3_dir.s1 baseAddress 0x00f0
add_connection nios2_qsys_0.data_master monster3_en.s1 avalon
set_connection_parameter_value nios2_qsys_0.data_master/monster3_en.s1 baseAddress 0x02c0
add_connection nios2_qsys_0.data_master monster3_x.s1 avalon
set_connection_parameter_value nios2_qsys_0.data_master/monster3_x.s1 baseAddress 0x02b0
add_connection nios2_qsys_0.data_master monster3_y.s1 avalon
set_connection_parameter_value nios2_qsys_0.data_master/monster3_y.s1 baseAddress 0x02a0
add_connection nios2_qsys_0.data_master nios2_qsys_0.debug_mem_slave avalon
set_connection_parameter_value nios2_qsys_0.data_master/nios2_qsys_0.debug_mem_slave baseAddress 0x1000
add_connection nios2_qsys_0.data_master onchip_memory2_0.s1 avalon
set_connection_parameter_value nios2_qsys_0.data_master/onchip_memory2_0.s1 baseAddress 0x0000
add_connection nios2_qsys_0.data_master otg_hpi_address.s1 avalon
set_connection_parameter_value nios2_qsys_0.data_master/otg_hpi_address.s1 baseAddress 0x03e0
add_connection nios2_qsys_0.data_master otg_hpi_cs.s1 avalon
set_connection_parameter_value nios2_qsys_0.data_master/otg_hpi_cs.s1 baseAddress 0x03a0
add_connection nios2_qsys_0.data_master otg_hpi_data.s1 avalon
set_connection_parameter_value nios2_qsys_0.data_master/otg_hpi_data.s1 baseAddress 0x03d0
add_connection nios2_qsys_0.data_master otg_hpi_r.s1 avalon
set_connection_parameter_value nios2_qsys_0.data_master/otg_hpi_r.s1 baseAddress 0x03c0
add_connection nios2_qsys_0.data_master otg_hpi_w.s1 avalon
set_connection_parameter_value nios2_qsys_0.data_master/otg_hpi_w.s1 baseAddress 0x03b0
add_connection nios2_qsys_0.data_master samus_dir.s1 avalon
set_connection_parameter_value nios2_qsys_0.data_master/samus_dir.s1 baseAddress 0x0130
add_connection nios2_qsys_0.data_master samus_en.s1 avalon
set_connection_parameter_value nios2_qsys_0.data_master/samus_en.s1 baseAddress 0x0370
add_connection nios2_qsys_0.data_master samus_jump.s1 avalon
set_connection_parameter_value nios2_qsys_0.data_master/samus_jump.s1 baseAddress 0x0330
add_connection nios2_qsys_0.data_master samus_up.s1 avalon
set_connection_parameter_value nios2_qsys_0.data_master/samus_up.s1 baseAddress 0x0110
add_connection nios2_qsys_0.data_master samus_walk.s1 avalon
set_connection_parameter_value nios2_qsys_0.data_master/samus_walk.s1 baseAddress 0x0340
add_connection nios2_qsys_0.data_master samus_x.s1 avalon
set_connection_parameter_value nios2_qsys_0.data_master/samus_x.s1 baseAddress 0x0360
add_connection nios2_qsys_0.data_master samus_y.s1 avalon
set_connection_parameter_value nios2_qsys_0.data_master/samus_y.s1 baseAddress 0x0350
add_connection nios2_qsys_0.data_master scene_sel.s1 avalon
set_connection_parameter_value nios2_qsys_0.data_master/scene_sel.s1 baseAddress 0x0120
add_connection nios2_qsys_0.data_master sdram.s1 avalon
set_connection_parameter_value nios2_qsys_0.data_master/sdram.s1 baseAddress 0x10000000
add_connection nios2_qsys_0.data_master sdram_pll.pll_slave avalon
set_connection_parameter_value nios2_qsys_0.data_master/sdram_pll.pll_slave baseAddress 0x03f0
add_connection nios2_qsys_0.data_master sysid_qsys_0.control_slave avalon
set_connection_parameter_value nios2_qsys_0.data_master/sysid_qsys_0.control_slave baseAddress 0x0408
add_connection nios2_qsys_0.data_master title_en.s1 avalon
set_connection_parameter_value nios2_qsys_0.data_master/title_en.s1 baseAddress 0x0160
add_connection nios2_qsys_0.data_master win_en.s1 avalon
set_connection_parameter_value nios2_qsys_0.data_master/win_en.s1 baseAddress 0x0140
add_connection nios2_qsys_0.instruction_master nios2_qsys_0.debug_mem_slave avalon
set_connection_parameter_value nios2_qsys_0.instruction_master/nios2_qsys_0.debug_mem_slave baseAddress 0x1000
add_connection nios2_qsys_0.instruction_master onchip_memory2_0.s1 avalon
set_connection_parameter_value nios2_qsys_0.instruction_master/onchip_memory2_0.s1 baseAddress 0x0000
add_connection nios2_qsys_0.instruction_master sdram.s1 avalon
set_connection_parameter_value nios2_qsys_0.instruction_master/sdram.s1 baseAddress 0x10000000
add_connection nios2_qsys_0.instruction_master sdram_pll.pll_slave avalon
set_connection_parameter_value nios2_qsys_0.instruction_master/sdram_pll.pll_slave baseAddress 0x03f0
add_connection nios2_qsys_0.instruction_master sysid_qsys_0.control_slave avalon
set_connection_parameter_value nios2_qsys_0.instruction_master/sysid_qsys_0.control_slave baseAddress 0x0408
add_connection nios2_qsys_0.irq jtag_uart_0.irq interrupt
set_connection_parameter_value nios2_qsys_0.irq/jtag_uart_0.irq irqNumber 5

# exported interfaces
add_interface b_emp conduit end
set_interface_property b_emp EXPORT_OF b_emp.external_connection
add_interface bullet1_en conduit end
set_interface_property bullet1_en EXPORT_OF bullet1_en.external_connection
add_interface bullet1_x conduit end
set_interface_property bullet1_x EXPORT_OF bullet1_x.external_connection
add_interface bullet1_y conduit end
set_interface_property bullet1_y EXPORT_OF bullet1_y.external_connection
add_interface bullet2_en conduit end
set_interface_property bullet2_en EXPORT_OF bullet2_en.external_connection
add_interface bullet2_x conduit end
set_interface_property bullet2_x EXPORT_OF bullet2_x.external_connection
add_interface bullet2_y conduit end
set_interface_property bullet2_y EXPORT_OF bullet2_y.external_connection
add_interface bullet3_en conduit end
set_interface_property bullet3_en EXPORT_OF bullet3_en.external_connection
add_interface bullet3_x conduit end
set_interface_property bullet3_x EXPORT_OF bullet3_x.external_connection
add_interface bullet3_y conduit end
set_interface_property bullet3_y EXPORT_OF bullet3_y.external_connection
add_interface clk clock sink
set_interface_property clk EXPORT_OF clk_0.clk_in
add_interface explosion1_en conduit end
set_interface_property explosion1_en EXPORT_OF explosion1_en.external_connection
add_interface explosion1_x conduit end
set_interface_property explosion1_x EXPORT_OF explosion1_x.external_connection
add_interface explosion1_y conduit end
set_interface_property explosion1_y EXPORT_OF explosion1_y.external_connection
add_interface explosion2_en conduit end
set_interface_property explosion2_en EXPORT_OF explosion2_en.external_connection
add_interface explosion2_x conduit end
set_interface_property explosion2_x EXPORT_OF explosion2_x.external_connection
add_interface explosion2_y conduit end
set_interface_property explosion2_y EXPORT_OF explosion2_y.external_connection
add_interface explosion3_en conduit end
set_interface_property explosion3_en EXPORT_OF explosion3_en.external_connection
add_interface explosion3_x conduit end
set_interface_property explosion3_x EXPORT_OF explosion3_x.external_connection
add_interface explosion3_y conduit end
set_interface_property explosion3_y EXPORT_OF explosion3_y.external_connection
add_interface health conduit end
set_interface_property health EXPORT_OF health.external_connection
add_interface key conduit end
set_interface_property key EXPORT_OF key.external_connection
add_interface keycode conduit end
set_interface_property keycode EXPORT_OF keycode.external_connection
add_interface kraid_as_dir conduit end
set_interface_property kraid_as_dir EXPORT_OF kraid_as_dir.external_connection
add_interface kraid_dir conduit end
set_interface_property kraid_dir EXPORT_OF kraid_dir.external_connection
add_interface kraid_g_en conduit end
set_interface_property kraid_g_en EXPORT_OF kraid_g_en.external_connection
add_interface kraid_n_en conduit end
set_interface_property kraid_n_en EXPORT_OF kraid_n_en.external_connection
add_interface kraid_r_en conduit end
set_interface_property kraid_r_en EXPORT_OF kraid_r_en.external_connection
add_interface kraid_shoot_en conduit end
set_interface_property kraid_shoot_en EXPORT_OF kraid_shoot_en.external_connection
add_interface kraid_spike_x conduit end
set_interface_property kraid_spike_x EXPORT_OF kraid_spike_x.external_connection
add_interface kraid_spike_y conduit end
set_interface_property kraid_spike_y EXPORT_OF kraid_spike_y.external_connection
add_interface kraid_throw_en conduit end
set_interface_property kraid_throw_en EXPORT_OF kraid_throw_en.external_connection
add_interface kraid_throw_x conduit end
set_interface_property kraid_throw_x EXPORT_OF kraid_throw_x.external_connection
add_interface kraid_throw_y conduit end
set_interface_property kraid_throw_y EXPORT_OF kraid_throw_y.external_connection
add_interface kraid_x conduit end
set_interface_property kraid_x EXPORT_OF kraid_x.external_connection
add_interface kraid_y conduit end
set_interface_property kraid_y EXPORT_OF kraid_y.external_connection
add_interface loss_en conduit end
set_interface_property loss_en EXPORT_OF loss_en.external_connection
add_interface monster1_en conduit end
set_interface_property monster1_en EXPORT_OF monster1_en.external_connection
add_interface monster1_x conduit end
set_interface_property monster1_x EXPORT_OF monster1_x.external_connection
add_interface monster1_y conduit end
set_interface_property monster1_y EXPORT_OF monster1_y.external_connection
add_interface monster2_en conduit end
set_interface_property monster2_en EXPORT_OF monster2_en.external_connection
add_interface monster2_x conduit end
set_interface_property monster2_x EXPORT_OF monster2_x.external_connection
add_interface monster2_y conduit end
set_interface_property monster2_y EXPORT_OF monster2_y.external_connection
add_interface monster3_dir conduit end
set_interface_property monster3_dir EXPORT_OF monster3_dir.external_connection
add_interface monster3_en conduit end
set_interface_property monster3_en EXPORT_OF monster3_en.external_connection
add_interface monster3_x conduit end
set_interface_property monster3_x EXPORT_OF monster3_x.external_connection
add_interface monster3_y conduit end
set_interface_property monster3_y EXPORT_OF monster3_y.external_connection
add_interface otg_hpi_address conduit end
set_interface_property otg_hpi_address EXPORT_OF otg_hpi_address.external_connection
add_interface otg_hpi_cs conduit end
set_interface_property otg_hpi_cs EXPORT_OF otg_hpi_cs.external_connection
add_interface otg_hpi_data conduit end
set_interface_property otg_hpi_data EXPORT_OF otg_hpi_data.external_connection
add_interface otg_hpi_r conduit end
set_interface_property otg_hpi_r EXPORT_OF otg_hpi_r.external_connection
add_interface otg_hpi_w conduit end
set_interface_property otg_hpi_w EXPORT_OF otg_hpi_w.external_connection
add_interface reset reset sink
set_interface_property reset EXPORT_OF clk_0.clk_in_reset
add_interface samus_dir conduit end
set_interface_property samus_dir EXPORT_OF samus_dir.external_connection
add_interface samus_en conduit end
set_interface_property samus_en EXPORT_OF samus_en.external_connection
add_interface samus_jump conduit end
set_interface_property samus_jump EXPORT_OF samus_jump.external_connection
add_interface samus_up conduit end
set_interface_property samus_up EXPORT_OF samus_up.external_connection
add_interface samus_walk conduit end
set_interface_property samus_walk EXPORT_OF samus_walk.external_connection
add_interface samus_x conduit end
set_interface_property samus_x EXPORT_OF samus_x.external_connection
add_interface samus_y conduit end
set_interface_property samus_y EXPORT_OF samus_y.external_connection
add_interface scene_sel conduit end
set_interface_property scene_sel EXPORT_OF scene_sel.external_connection
add_interface sdram_clk clock source
set_interface_property sdram_clk EXPORT_OF sdram_pll.c1
add_interface sdram_wire conduit end
set_interface_property sdram_wire EXPORT_OF sdram.wire
add_interface title_en conduit end
set_interface_property title_en EXPORT_OF title_en.external_connection
add_interface win_en conduit end
set_interface_property win_en EXPORT_OF win_en.external_connection

set_interconnect_requirement {$system} qsys_mm.clockCrossingAdapter AUTO
set_interconnect_requirement {$system} qsys_mm.enableEccProtection FALSE
set_interconnect_requirement {$system} qsys_mm.insertDefaultSlave FALSE
set_interconnect_requirement {$system} qsys_mm.maxAdditionalLatency 1

save_system nios_system.qsys
